# EAGLE design Arduino (EAGLE 9.6.2)
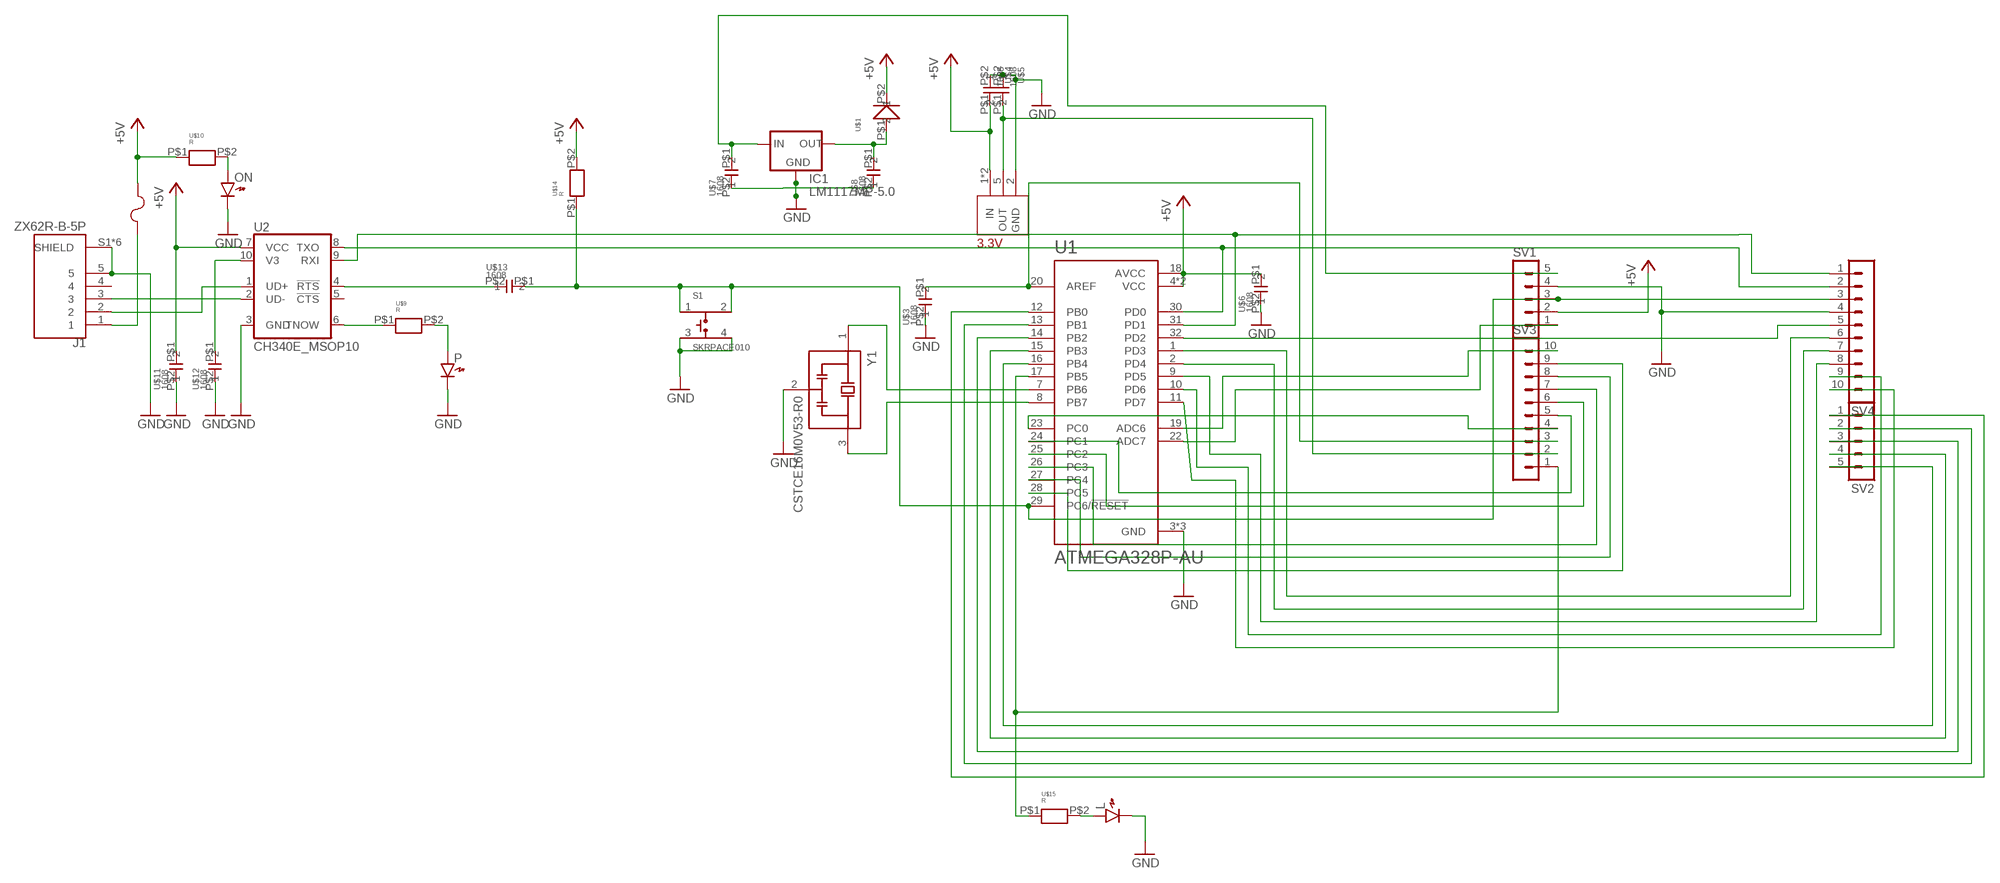
[diagram p0: schematic, sheet 1]

## Parts
IC1  LM1117MP-5.0  [SOT223]
J1  ZX62R-B-5P  [HRS_ZX62R-B-5P]
L  LED1608  [LED1608]
ON  LED1608  [LED1608]
P  LED1608  [LED1608]
S1  SKRPACE010  [SW_SKRPACE010]
SV1  MA05-1  [MA05-1]
SV2  MA05-1  [MA05-1]
SV3  MA10-1  [MA10-1]
SV4  MA10-1  [MA10-1]
U1  ATMEGA328P-AU  [QFP80P900X900X120-32N]
U2  CH340E_MSOP10  [MSOP10]
U$1  D  [D]
U$2  3.3V  [SOT95P285X140-5N]
U$3  1608  [CON]
U$4  1608  [CON]
U$5  1608  [CON]
U$6  1608  [CON]
U$7  1608  [CON]
U$8  1608  [CON]
U$9  R  [1608]
U$10  R  [1608]
U$11  1608  [CON]
U$12  1608  [CON]
U$13  1608  [CON]
U$14  R  [1608]
U$15  R  [1608]
U$16  F  [F]
Y1  CSTCE16M0V53-R0  [OSC_CSTCE16M0V53-R0]

## Nets
+5V: SV1.2 U1.4(VCC) U1.6(VCC) U1.18(AVCC) U2.7(VCC) U$1.P$2 U$2.1(IN) U$2.3(IN) U$4.P$1 U$6.P$1 U$10.P$1 U$11.P$1 U$14.P$2 U$16.P$2
AREF: SV3.3 U1.20(AREF) U$3.P$1
GND: IC1.1(GND) J1.5 J1.S1(SHIELD) J1.S2(SHIELD) J1.S3(SHIELD) J1.S4(SHIELD) J1.S5(SHIELD) J1.S6(SHIELD) L.K ON.K P.K S1.3 S1.4 SV1.4 SV4.4 U1.3(GND) U1.5(GND) U1.21(GND) U2.3(GND) U$2.2(GND) U$3.P$2 U$4.P$2 U$5.P$2 U$6.P$2 U$7.P$2 U$8.P$2 U$11.P$2 U$12.P$2 Y1.2(GND)
N$1: U1.7(PB6) Y1.1(IN)
N$2: U1.8(PB7) Y1.3(OUT)
N$3: SV4.1 U1.31(PD1) U2.9(RXI)
N$4: SV3.4 U1.23(PC0)
N$5: J1.1 U$16.P$1
N$6: SV3.2 U$2.5(OUT) U$5.P$1
N$7: SV1.1 U1.22(ADC7)
N$9: IC1.2(OUT) IC1.4(OUT) U$1.P$1 U$8.P$1
N$10: IC1.3(IN) SV1.5 U$7.P$1
N$11: SV3.5 U1.24(PC1)
N$12: ON.A U$10.P$2
N$13: J1.2 U2.1(UD+)
N$14: J1.3 U2.2(UD-)
N$15: SV4.2 U1.30(PD0) U2.8(TXO)
N$16: U2.10(V3) U$12.P$1
N$17: U2.6(TNOW) U$9.P$1
N$18: P.A U$9.P$2
N$19: U2.4(!RTS) U$13.P$2
N$20: S1.1 S1.2 SV1.3 SV4.3 U1.29(PC6/!RESET) U$13.P$1 U$14.P$1
N$21: SV3.10 U1.19(ADC6)
N$22: SV3.6 U1.25(PC2)
N$23: SV3.7 U1.26(PC3)
N$24: SV3.8 U1.27(PC4)
N$25: SV3.9 U1.28(PC5)
N$26: SV3.1 U1.17(PB5) U$15.P$1
N$27: SV2.5 U1.16(PB4)
N$28: SV2.4 U1.15(PB3)
N$29: SV2.3 U1.14(PB2)
N$30: SV2.2 U1.13(PB1)
N$31: SV2.1 U1.12(PB0)
N$32: SV4.8 U1.9(PD5)
N$33: SV4.5 U1.32(PD2)
N$34: SV4.6 U1.1(PD3)
N$35: SV4.7 U1.2(PD4)
N$36: SV4.9 U1.10(PD6)
N$37: SV4.10 U1.11(PD7)
N$38: L.A U$15.P$2
Unconnected: J1.4 U2.5(!CTS)

## Library data of the parts
IC1 = lm1117:LM1117?-*: 800mA Low-Dropout Linear Regulator Source: http://ww1.microchip.com/downloads/en/DeviceDoc/39760d.pdf; MF: Texas Instruments; MPN: LM1117MP-5.0; OC_FARNELL: 9778209; OC_NEWARK: 28X3417
J1 = ZX62R-B-5P:ZX62R-B-5P: Conn Micro USB 2.0 Type B RCP 5 POS 0.65mm Solder RA SMD 5 Terminal 1 Port Embossed T/R Check prices <https://pricing.snapeda.com/parts/ZX62R-B-5P/Hirose/view-part?ref=eda>; AVAILABILITY: In Stock; DESCRIPTION: USB - micro B USB 2.0 Receptacle Connector 5 Position Surface Mount, Right Angle; MF: Hirose; MP: ZX62R-B-5P; PACKAGE: None; PRICE: None
L ON P = generic:LED: Generic LEDs
S1 = SKRPACE010:SKRPACE010: Switch Tactile N.O. SPST Button J-Bend 0.05A 16VDC 2.55N SMD Automotive T/R Check prices <https://pricing.snapeda.com/parts/SKRPACE010/ALPS/view-part?ref=eda>; AVAILABILITY: In Stock; DESCRIPTION: Switch Tactile N.O. SPST Button J-Bend 0.05A 16VDC 2.55N SMD Automotive T/R; MF: ALPS; MP: SKRPACE010; PACKAGE: None; PRICE: None
SV1 SV2 = con-lstb:MA05-1: PIN HEADER; OC_FARNELL: unknown; OC_NEWARK: unknown
SV3 SV4 = con-lstb:MA10-1: PIN HEADER; OC_FARNELL: unknown; OC_NEWARK: unknown
U1 = ATMEGA328P-AU:ATMEGA328P-AU: ATmega Series 20 MHz 32 KB Flash 2 KB SRAM 8-Bit Microcontroller - TQFP-32 Check prices <https://pricing.snapeda.com/parts/ATMEGA328P-AU/Microchip%20Technology/view-part?ref=eda>; AVAILABILITY: In Stock; DESCRIPTION: AVR AVR® ATmega Microcontroller IC 8-Bit 20MHz 32KB (16K x 16) FLASH 32-TQFP (7x7); MF: Microchip Technology; MP: ATMEGA328P-AU; PACKAGE: TQFP-32 Microchip; PRICE: None
U2 = CH340E:CH340E: Check prices <https://pricing.snapeda.com/parts/CH340E/WCH/view-part?ref=eda>; AVAILABILITY: No availability data; DESCRIPTION: USB to serial chip CH340; MF: WCH; MP: CH340E; PACKAGE: Package; PRICE: None
U$1 = D 40V2A:D
U$2 = SOT95P285X140-5N:3.3V
U$3-U$8 U$11-U$13 = con1608:1608
U$9 U$10 U$14 U$15 = R 1608:R
U$16 = F:F
Y1 = CSTCE16M0V53-R0:CSTCE16M0V53-R0: 20MHz Ceramic Resonator Built in Capacitor 15pF +/- 0.2% -40C - 125C Surface Mount; MANUFACTURER: Murata; MAXIMUM_PACKAGE_HEIGHT: 1.00mm; PARTREV: May 7, 2019; STANDARD: Manufacturer Recommendations

## Board
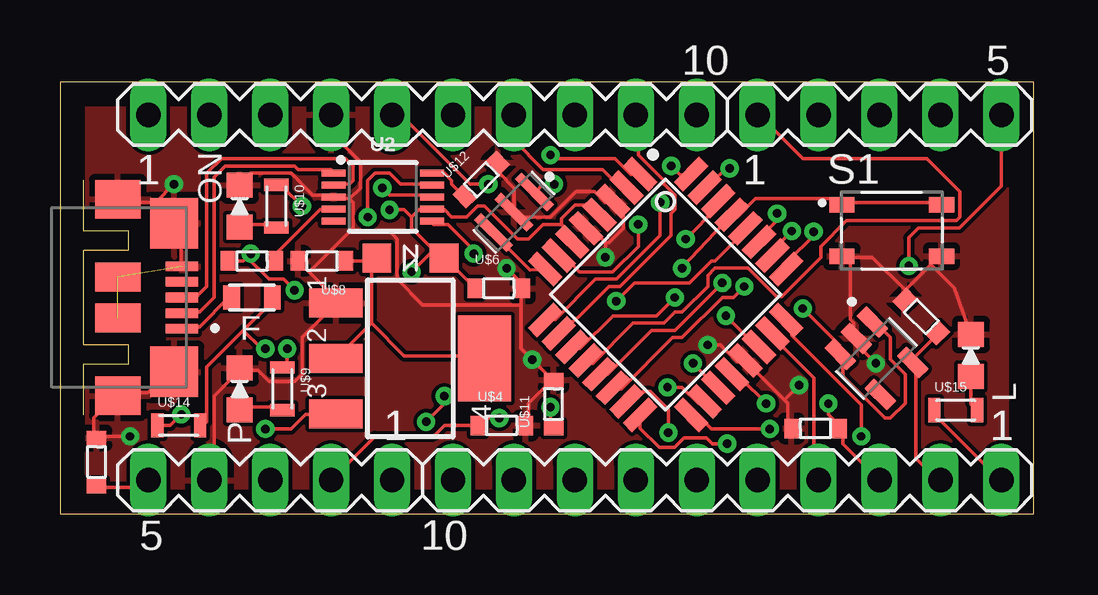
[diagram p1: board, top side]
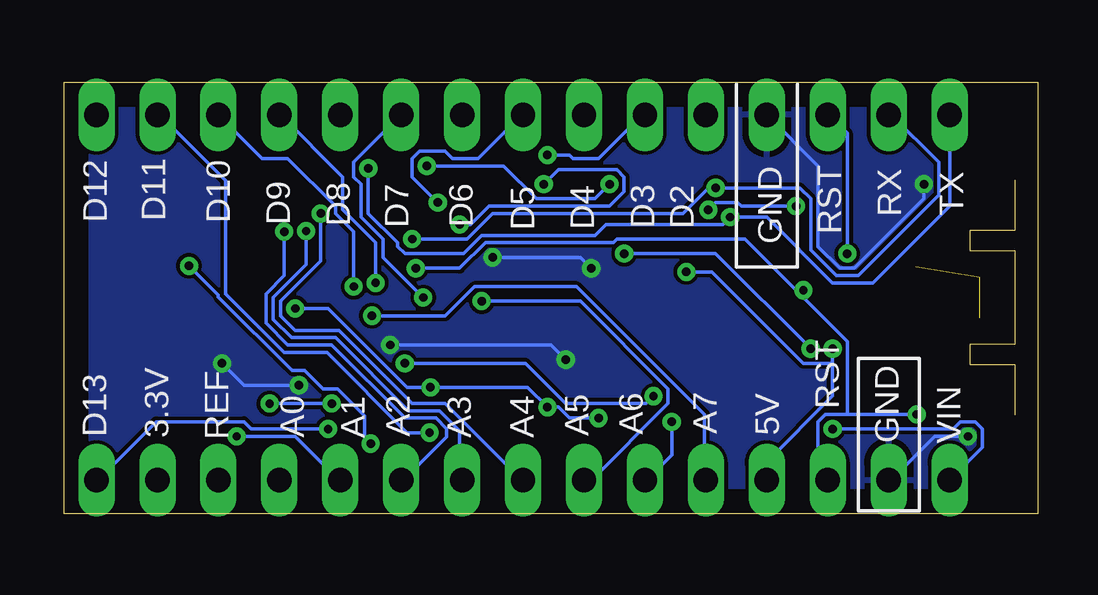
[diagram p2: board, bottom side, seen from below]

Size 40.6 x 18 mm. Coordinates in mm from the lower left corner, seen from the top.
Outline: 0,0 40.6,0 40.6,18 0,18 0,0
Copper layers (1*16): Top 0.035mm / dielectric 1.5mm / Bottom 0.035mm
Design rules "default": minimum track width 6mil, minimum drill 0.35mm, track to track 6mil, track to pad 6mil, pad to pad 6mil, via to via 6mil, smd to smd 6mil, copper to edge 40mil, drill to drill 6mil, minimum pad ring 10mil, minimum via ring 8mil, stop-mask expansion 4mil, vias tented up to drill 0mil, thermal gap 10mil

### Footprints (pad centres in the part's own frame; a part is rotated, then mirrored left to right if it is on the bottom)
SOT223 = smd 1.219 x 2.235: 1 -2.311,-3.099; 2 0,-3.099; 3 2.311,-3.099 | smd 3.6 x 2.2: 4 0,3.099
HRS_ZX62R-B-5P = smd 0.4 x 1.35: 1 1.3,2.675; 2 0.65,2.675; 3 0,2.675; 4 -0.65,2.675; 5 -1.3,2.675 | smd 2.1 x 2: S1 -3.1,2.35; S2 3.1,2.35 | smd 1.6 x 1.9: S3 -4.1,0; S4 4.1,0 | smd 1.2 x 1.9: S5 -0.85,0; S6 0.85,0
LED1608 = smd 1.05 x 1.08: A -0.875,0; K 0.875,0
SW_SKRPACE010 = smd 1.05 x 0.65: 1 -2.075,1.075; 2 2.075,1.075; 3 -2.075,-1.075; 4 2.075,-1.075
MA05-1 = drill 1.016 long: 1 -5.08,0; 2 -2.54,0; 3 0,0; 4 2.54,0; 5 5.08,0
MA10-1 = drill 1.016 long: 1 -11.43,0; 2 -8.89,0; 3 -6.35,0; 4 -3.81,0; 5 -1.27,0; 6 1.27,0; 7 3.81,0; 8 6.35,0; 9 8.89,0; 10 11.43,0
QFP80P900X900X120-32N = smd 1.5 x 0.55: 1 -4.3,2.8; 2 -4.3,2; 3 -4.3,1.2; 4 -4.3,0.4; 5 -4.3,-0.4; 6 -4.3,-1.2; 7 -4.3,-2; 8 -4.3,-2.8; 17 4.3,-2.8; 18 4.3,-2; 19 4.3,-1.2; 20 4.3,-0.4; 21 4.3,0.4; 22 4.3,1.2; 23 4.3,2; 24 4.3,2.8 | smd 0.55 x 1.5: 9 -2.8,-4.3; 10 -2,-4.3; 11 -1.2,-4.3; 12 -0.4,-4.3; 13 0.4,-4.3; 14 1.2,-4.3; 15 2,-4.3; 16 2.8,-4.3; 25 2.8,4.3; 26 2,4.3; 27 1.2,4.3; 28 0.4,4.3; 29 -0.4,4.3; 30 -1.2,4.3; 31 -2,4.3; 32 -2.8,4.3
MSOP10 = smd 1 x 0.3: 1 -2.05,1; 2 -2.05,0.5; 3 -2.05,0; 4 -2.05,-0.5; 5 -2.05,-1; 6 2.05,-1; 7 2.05,-0.5; 8 2.05,0; 9 2.05,0.5; 10 2.05,1
D = smd 1.2 x 1.2: P$1 -1.4,0; P$2 1.4,0
SOT95P285X140-5N = smd 1.35 x 0.6: 1 -1.185,0.95; 2 -1.185,0; 3 -1.185,-0.95; 4 1.185,-0.95; 5 1.185,0.95
CON = smd 0.6 x 0.813: P$1 -1,0; P$2 1,0
1608 = smd 0.508 x 1.016: P$1 -0.889,0; P$2 0.889,0
F = smd 0.7 x 1: P$1 -0.85,0; P$2 0.85,0
OSC_CSTCE16M0V53-R0 = smd 0.4 x 1.9: 1 -1.2,0; 2 0,0; 3 1.2,0

### Placement (x,y rotation side)
IC1  14.61,6.48 270 top
J1  2.41,9.02 270 top
L  37.97,6.6 90 top
ON  7.49,12.83 90 top
P  7.49,5.21 90 top
S1  34.67,11.81 0 top
SV1  8.76,1.4 180 top
SV2  34.16,16.64 0 top
SV3  27.81,1.4 180 top
SV4  15.11,16.64 0 top
U1  25.25,9.14 315 top
U2  13.46,13.21 0 top
U$1  14.61,10.67 0 top
U$2  34.04,6.48 315 top
U$3  31.5,3.56 180 top
U$4  18.41,3.68 0 top
U$5  35.9,8.22 135 top
U$6  18.29,9.4 0 top
U$7  1.52,2.16 90 top
U$8  10.92,10.54 180 top
U$9  9.27,5.21 270 top
U$10  9.02,12.83 270 top
U$11  20.57,4.57 90 top
U$12  17.56,13.93 45 top
U$13  8,10.54 0 top
U$14  4.95,3.68 0 top
U$15  37.34,4.32 0 top
U$16  8,9.02 0 top
Y1  18.92,12.57 225 top

### Tracks (layer width: path | path; a pad name or v marks a point on that pad's centre or on a via)
+5V  (via drill 0.35)
  Top 0.152: 20.9,12.06 21.36,11.61 U1.6 | 20.9,12.06 20.9,12.31 21.48,12.88 21.92,12.88 22.25,12.55 U1.4 | U$6.P$1 17.25,9.47 16.03,10.69 U$1.P$2 | 14.66,12.37 14.96,12.68 15.42,12.68 U2.7 15.57,12.68 16.03,12.68 16.33,12.37 16.94,12.37 17.4,12.83 17.7,12.83 19.07,11.46 19.53,11.46 20.14,12.06 20.9,12.06 | 14.66,12.37 14.66,11.91 15.57,11 | 15.57,11 15.88,10.69 U$1.P$2 | v10.08,12.83 9.32,13.59 9.02,13.59 U$10.P$1 | v13.74,12.68 14.35,12.68 14.66,12.37 | 7.64,7.64 6.12,6.12 6.12,3.83 5.97,3.68 U$14.P$2 | 7.64,7.64 8.71,8.71 8.71,9.02 U$16.P$2 | U$2.1 34.01,7.95 34.62,7.34 34.62,6.43 35.23,5.82 35.23,4.6 34.62,3.99 34.39,3.99 32.64,5.74 32.64,6.58 U$2.3 32.49,6.73 32.49,7.04 v30.96,8.56 | SV1.2 13.13,3.23 15.57,3.23 16.03,3.68 U$4.P$1 17.55,3.68 17.86,3.99 v18.31,3.99 | v20.45,4.45 20.45,3.68 U$11.P$1 | v25.32,5.27 25.93,5.27 26.61,4.6 26.74,4.6 U1.18 | 7.64,7.64 8.41,6.88 v8.56,6.88 | v14.66,10.08 15.57,11 | 15.57,11 U$1.P$2
  Bottom 0.152: v10.08,12.83 12.37,12.83 12.52,12.98 13.44,12.98 v13.74,12.68 | v18.31,3.99 19.53,3.99 19.99,4.45 v20.45,4.45 21.27,5.27 v25.32,5.27 26.3,5.27 29.59,8.56 v30.96,8.56 | 8.56,6.27 8.56,4.9 11.3,2.16 SV1.2 | 8.56,6.27 v8.56,6.88 | v14.66,10.08 13.59,10.08 9.78,6.27 8.56,6.27
AREF  (via drill 0.35)
  Top 0.152: SV3.3 32.64,2.92 32.64,3.53 U$3.P$1 32.49,3.68 32.03,4.14 v32.03,4.6 | v29.44,4.6 28.37,5.66 28.2,5.66 U1.20
  Bottom 0.152: v32.03,4.6 v29.44,4.6
GND  (via drill 0.35)  (2 unrouted)
  Top 0.152: 30.2,4.75 U1.21 28.25,6.32 27.53,7.04 v27,7.04 | 30.2,4.75 30.35,4.6 30.35,3.68 U$3.P$2 | 35.23,9.32 35.23,9.02 U$5.P$2 35.23,9.32 | 36.3,10.39 36.6,10.69 S1.4 | 36.3,10.39 35.23,9.32 | 32.94,10.69 33.86,10.69 35.23,9.32 | 32.94,10.69 32.64,10.69 S1.3 32.94,10.69 | 36.3,10.39 37.28,9.41 L.K | 32.94,10.69 32.94,8.1 33.1,7.95 33.1,7.34 U$2.2 33.1,7.19 v34.01,6.27 | v30.81,5.36 30.2,4.75 | 1.52,3.23 U$7.P$2 | J1.S2 4.75,5.82 4.45,5.82 3.68,5.05 2.46,5.05 J1.S4 2.31,4.9 1.4,3.99 1.4,3.23 1.52,3.23 | 7.49,5.97 6.43,4.9 6.43,1.55 6.27,1.4 SV1.4 | v2.92,3.23 1.52,3.23 | 22.73,11.3 22.28,11.76 22.13,11.76 U1.5 | 22.73,11.3 22.89,11.3 23.5,11.91 23.5,12.52 23.24,12.77 U1.3 23.02,12.98 22.73,12.98 22.28,13.44 21.51,13.44 20.45,12.37 19.07,12.37 18.92,12.52 Y1.2 18.92,13.59 18.31,14.2 18.31,14.5 U$12.P$2 | J1.5 5.05,10.39 5.05,11.91 4.9,12.06 J1.S1 | 3.99,12.98 2.46,12.98 J1.S3 | 3.99,12.98 4.75,12.22 J1.S1 | U$4.P$2 19.53,3.68 19.53,4.6 20.45,5.51 U$11.P$2 20.45,5.66 v19.68,6.43 19.23,6.88 19.23,8.71 | 19.23,8.71 19.23,9.32 U$6.P$2 19.38,9.47 v18.62,10.24 | ON.K 7.49,13.74 7.95,14.2 9.63,14.2 10.54,13.28 11.3,13.28 U2.3 11.46,13.13 12.06,13.13 | 10.39,10.08 11.61,8.87 IC1.1 11.46,8.71 10.08,7.34 10.08,5.82 9.78,5.51 8.71,5.51 8.26,5.97 7.49,5.97 | 10.39,10.08 U$8.P$2 | 12.06,13.13 12.22,12.98 12.22,11.91 12.06,11.76 | 10.39,10.08 12.06,11.76 | SV4.4 11.3,15.88 12.52,14.66 12.52,13.59 12.06,13.13 | 19.23,8.71 15.11,8.71 14.05,9.78 14.05,11.46 13.74,11.76 12.06,11.76 | v4.75,13.74 3.99,12.98 | 3.99,12.98 J1.S1 | v22.73,10.69 22.73,11.3 | 7.49,5.97 P.K
  Bottom 0.152: v30.81,5.36 33.1,5.36 v34.01,6.27 | v2.92,3.23 4.29,3.23 6.12,1.4 SV1.4 | v4.75,13.74 4.75,13.13 7.64,10.24 8.26,10.24 9.17,11.15 9.17,14.5 SV4.4 | v22.73,10.69 19.07,10.69 v18.62,10.24 | v27,7.04 20.3,7.04 v19.68,6.43
  pour Top: -0.13,17.91 -0.13,0.13 40.51,0.13 40.51,17.91
  pour Bottom: -0.13,17.91 -0.13,0.13 40.51,0.13 40.51,17.91
N$1  (via drill 0.35)
  Top 0.152: v24.11,12.06 24.11,11.15 23.04,10.08 21.67,10.08 21.21,10.54 20.98,10.54 U1.7 | v20.6,13.74 20.14,13.74 19.84,13.44 Y1.1
  Bottom 0.152: v24.11,12.06 23.65,12.06 22.89,12.83 17.86,12.83 17.25,13.44 17.25,14.05 17.55,14.35 19.99,14.35 v20.6,13.74
N$2
  Top 0.152: U1.8 19.6,10.17 18.16,11.61 Y1.3
N$3  (via drill 0.35)
  Top 0.152: v12.83,12.37 12.83,13.89 13.13,14.2 13.74,14.2 14.2,13.74 15.42,13.74 U2.9 | v27.91,14.4 27.81,14.4 U1.31
  Bottom 0.152: SV4.1 3.68,12.83 6.88,9.63 8.56,9.63 11.3,12.37 v12.83,12.37 13.13,12.06 18.01,12.06 18.47,11.61 23.19,11.61 23.95,10.85 26.39,10.85 26.7,11.15 26.7,11.3 27.91,12.52 v27.91,14.4
N$4
  Top 0.152: U1.23 29.76,7.32 31.42,5.66 31.42,1.55 31.57,1.4 SV3.4
N$5
  Top 0.152: U$16.P$1 7.04,9.02 5.82,7.8 5.21,7.8 J1.1
N$6
  Top 0.152: U$5.P$1 36.6,7.49 35.53,6.43 U$2.5 35.69,6.27 35.69,2.31 36.6,1.4 SV3.2
N$7  (via drill 0.35)
  Top 0.152: v27.76,8.26 29,7.02 U1.22
  Bottom 0.152: v27.76,8.26 24.71,8.26 23.5,9.47 19.23,9.47 13.89,4.14 13.89,1.4 SV1.1
N$9
  Top 0.152: 12.98,10.54 13.13,10.54 U$1.P$1 12.98,10.54 | 12.98,10.54 U$8.P$1 | 12.98,7.95 12.98,10.54 | IC1.2 12.98,7.95 | 12.98,7.95 14.35,6.58 17.7,6.58 IC1.4
N$10  (via drill 0.35)
  Top 0.152: SV1.5 3.39,1.1 1.52,1.1 U$7.P$1 | v8.56,3.53 9.63,3.53 10.24,4.14 11.46,4.14 IC1.3
  Bottom 0.152: v8.56,3.53 3.53,3.53 3.23,3.83 2.62,3.83 2.31,3.53 2.31,2.77 SV1.5
N$11  (via drill 0.35)
  Top 0.152: v33.4,3.23 33.4,4.53 30.5,7.43 30.5,8.06 U1.24
  Bottom 0.152: v33.4,3.23 30.96,3.23 29.13,1.4 SV3.5
N$12
  Top 0.152: U$10.P$2 9.02,12.06 7.49,12.06 ON.A
N$13
  Top 0.152: U2.1 11.3,14.35 9.93,14.35 9.78,14.5 6.88,14.5 6.43,14.05 6.43,9.02 5.82,8.41 5.21,8.41 J1.2
N$14
  Top 0.152: J1.3 5.66,9.02 6.12,9.47 6.12,14.2 6.73,14.81 11.91,14.81 12.22,14.5 12.22,13.89 12.06,13.74 11.46,13.74 U2.2
N$15  (via drill 0.35)
  Top 0.152: v13.44,13.59 13.74,13.28 15.42,13.28 U2.8 | v26.09,11.46 27.42,12.79 U1.30
  Bottom 0.152: SV4.2 6.12,16.64 4.14,14.66 4.14,13.28 7.49,9.93 8.41,9.93 9.47,11 9.47,13.13 9.93,13.59 v13.44,13.59 13.74,13.59 14.81,12.52 22.73,12.52 23.8,11.46 v26.09,11.46
N$16
  Top 0.152: U$12.P$1 16.79,13.28 16.33,13.74 16.33,13.89 16.03,14.2 15.57,14.2 U2.10
N$17  (via drill 0.35)
  Top 0.152: v17.25,10.85 17.25,11 16.18,12.06 15.57,12.06 U2.6 | v9.47,6.88 9.47,6.27 9.32,6.12 U$9.P$1
  Bottom 0.152: v17.25,10.85 13.44,10.85 v9.47,6.88
N$18
  Top 0.152: U$9.P$2 9.17,4.45 7.49,4.45 P.A
N$19
  Top 0.152: U$13.P$2 9.02,10.54 9.02,10.85 10.85,12.68 11.3,12.68 U2.4
N$20  (via drill 0.35)
  Top 0.152: U$13.P$1 7.64,10.54 7.8,10.69 | S1.2 36.6,12.98 32.64,12.98 S1.1 32.49,12.98 32.33,13.13 28.99,13.13 28.23,12.37 28.13,12.37 U1.29 25.93,10.27 v25.93,10.24 | U$14.P$1 4.6,3.68 v5.05,4.14 | 7.8,10.69 8.71,9.78 9.32,9.78 v9.78,9.32 | 7.8,10.69 v7.95,10.85
  Bottom 0.152: v7.95,10.85 7.95,15.88 8.71,16.64 SV4.3 | 7.95,4.14 8.87,4.14 9.17,3.83 9.17,1.7 8.87,1.4 SV1.3 | 7.95,4.14 v5.05,4.14 | v25.93,10.24 24.11,10.24 23.04,11.3 17.7,11.3 17.55,11.46 12.22,11.46 9.93,9.17 | 9.93,9.17 7.95,7.19 7.95,4.14 | 9.93,9.17 v9.78,9.32
N$21  (via drill 0.35)
  Top 0.152: v26.39,6.27 27.41,5.26 U1.19 | v16.03,4.9 16.03,4.6 v15.27,3.83
  Bottom 0.152: v26.39,6.27 21.36,6.27 19.68,4.6 16.33,4.6 v16.03,4.9 | v15.27,3.83 15.27,2.46 16.33,1.4 SV3.10
N$22  (via drill 0.35)
  Top 0.152: v31.42,11.76 31.42,11.61 30.35,10.54 30.35,10.21 U1.25
  Bottom 0.152: v31.42,11.76 31.42,9.93 32.18,9.17 32.18,7.95 31.27,7.04 29.44,7.04 26.39,3.99 25.09,3.99 24.65,3.54 24.65,3.21 26.47,1.4 SV3.6
N$23  (via drill 0.35)
  Top 0.152: v30.5,11.79 29.74,11.02 29.74,10.9 U1.26
  Bottom 0.152: v30.5,11.79 30.5,10.39 31.88,9.02 31.88,8.1 31.11,7.34 29.29,7.34 26.24,4.29 24.94,4.29 24.11,3.45 24.11,1.4 SV3.7
N$24  (via drill 0.35)
  Top 0.152: v29.9,12.52 29.9,12.22 29.29,11.61 29.29,11.45 U1.27
  Bottom 0.152: v29.9,12.52 29.9,10.54 31.57,8.87 31.57,8.26 30.96,7.64 29.13,7.64 26.09,4.6 24.71,4.6 21.51,1.4 SV3.8
N$25  (via drill 0.35)
  Top 0.152: v23.19,8.87 23.95,9.63 26.24,9.63 27.15,10.54 27.3,10.54 28.55,11.78 U1.28
  Bottom 0.152: v23.19,8.87 19.07,8.87 15.42,5.21 15.42,4.6 18.62,1.4 SV3.9
N$26  (via drill 0.35)
  Top 0.152: U$15.P$1 36.45,4.14 39.19,1.4 SV3.1 | v29.59,3.53 27.15,3.53 26.7,3.99 26.4,4.03 U1.17
  Bottom 0.152: v29.59,3.53 32.79,3.53 33.1,3.83 36.75,3.83 39.19,1.4 SV3.1
N$27  (via drill 0.35)
  Top 0.152: SV2.5 39.24,13.67 37.49,11.91 35.79,11.91 35.38,11.51 v35.38,10.34 | U1.16 24.19,3.56 24.98,2.77 25.27,2.77 25.28,2.77 25.61,2.77 26,3.16 26.95,3.16 27.2,2.92 v27.81,2.92
  Bottom 0.152: v35.38,10.34 34.16,9.11 34.16,9.04 31.09,5.97 30.56,5.97 29.8,5.2 29.19,5.2 28.07,4.08 28.07,3.17 v27.81,2.92
N$28  (via drill 0.35)
  Top 0.152: v25.36,3.38 25.36,4.34 24.61,5.09 24.31,5.09 23.81,4.6 23.62,4.6 U1.15
  Bottom 0.152: v25.36,3.38 26.29,3.38 29.64,6.73 31.42,6.73 33.86,9.17 33.86,13.89 36.6,16.64 SV2.4
N$29  (via drill 0.35)
  Top 0.152: v28.52,9.47 28.07,9.02 27.61,9.02 25.93,7.34 25.54,7.34 23.41,5.21 23.12,5.21 U1.14
  Bottom 0.152: v28.52,9.47 28.52,11.76 29.29,12.52 29.29,12.83 31.27,14.81 32.33,14.81 SV2.3
N$30  (via drill 0.35)
  Top 0.152: v27.61,9.63 25.63,7.64 24.65,7.64 22.82,5.82 U1.13
  Bottom 0.152: v27.61,9.63 27.61,11.3 28.98,12.68 28.98,14.05 31.57,16.64 SV2.2
N$31
  Top 0.152: U1.12 22.09,6.27 22.21,6.27 23.89,7.95 25.17,7.95 25.63,8.41 25.93,8.41 27,9.47 27,9.93 27.3,10.24 28.68,10.24 29.86,9.05 30.09,9.05 31.73,10.69 31.73,11.15 32.79,12.22 37.36,12.22 37.52,12.37 37.52,13.44 36.14,14.81 30.96,14.81 29.13,16.64 SV2.1
N$32  (via drill 0.35)
  Top 0.152: v25.02,12.98 25.02,11.61 23.19,9.78 22.33,9.78 20.65,8.1 20.23,8.1 U1.9
  Bottom 0.152: v25.02,12.98 26.09,14.05 26.09,14.81 25.78,15.11 24.71,15.11 24.41,14.81 23.34,14.81 21.51,16.64 SV4.8
N$33  (via drill 0.35)
  Top 0.152: v25.48,14.5 25.86,14.12 U1.32 | v17.86,13.74 17.09,13.74 14.2,16.64 SV4.5
  Bottom 0.152: v25.48,14.5 22.28,14.5 20.9,13.13 18.47,13.13 v17.86,13.74
N$34  (via drill 0.35)
  Top 0.152: v20.45,14.96 20.6,14.81 23.13,14.81 23.8,14.13 U1.1
  Bottom 0.152: v20.45,14.96 19.53,14.96 19.38,14.81 18.31,14.81 16.48,16.64 SV4.6
N$35
  Top 0.152: SV4.7 18.92,15.57 20.14,14.35 22.61,14.35 23.37,13.59 U1.2
N$36
  Top 0.152: U1.10 21.64,8.23 22.89,9.47 23.34,9.47 25.48,11.61 25.48,12.52 25.63,12.68 25.63,13.28 25.17,13.74 25.17,13.89 24.11,14.96 24.11,16.64 SV4.9
N$37  (via drill 0.35)
  Top 0.152: U1.11 21.51,6.88 21.68,6.88 23.05,8.26 24.87,8.26 v25.63,9.02
  Bottom 0.152: v25.63,9.02 27.3,10.69 27.3,11.46 28.22,12.37 28.22,13.74 28.52,14.05 28.52,14.66 SV4.10
N$38
  Top 0.152: U$15.P$2 37.97,4.57 L.A

### Text on the board
tPlace: F
bPlace: RST | D10 | D12 | TX | RX | GND | D2 | D3 | D4 | D5 | D6 | D7 | D8 | D9 | D11 | VIN | RST | GND | 5V | A7 | A6 | A5 | A4 | A3 | A2 | A1 | A0 | REF | 3.3V | D13